# Altium schematic sheet PressureSensorBreakout.SchDoc
size A
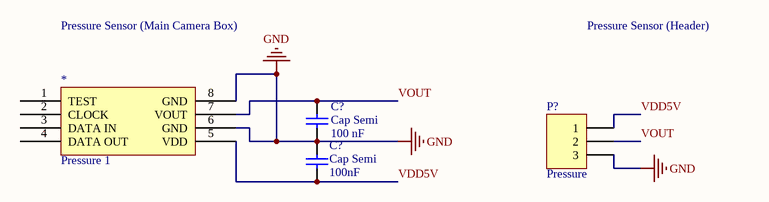
[diagram p0: PressureSensorBreakout.SchDoc]

## Parts
(Parts that share a designator on the sheet are numbered #1, #2 ... from top to bottom, then left to right.)
*  Pressure 1
C?#1  Cap Semi  value 100 nF  [C1206]
C?#2  Cap Semi  value 100nF  [C1206]
P?  Pressure  [HDR1X3]

## Nets
GND: *.6(GND) *.8(GND) C?#1.1 C?#2.2 P?.3
VDD5V: *.5(VDD) C?#2.1 P?.1
VOUT: *.7(VOUT) C?#1.2 P?.2

Not connected (* = marked no-connect by the designer): * 1(TEST) 2(CLOCK) 3(DATA_IN) 4(DATA_OUT)

## Notes on the sheet
- Pressure Sensor (Main Camera Box)
- Pressure Sensor (Header)

## Library data of the parts
* = Component_1
C?#1 C?#2 = Cap Semi: Capacitor (Semiconductor SIM Model); Published: 8-Jun-2000; LatestRevisionDate: 29-May-2009; LatestRevisionNote: IPC-7351 Footprint Added.; PackageReference: C1206; Publisher: Altium Limited; PackageDescription: Chip Capacitor
P? = Header 3: Header, 3-Pin; LatestRevisionDate: 17-Jul-2002; LatestRevisionNote: Re-released for DXP Platform.; Publisher: Altium Limited